# EAGLE design NeoPixel_6x4_Matrix (EAGLE 9.4.2)
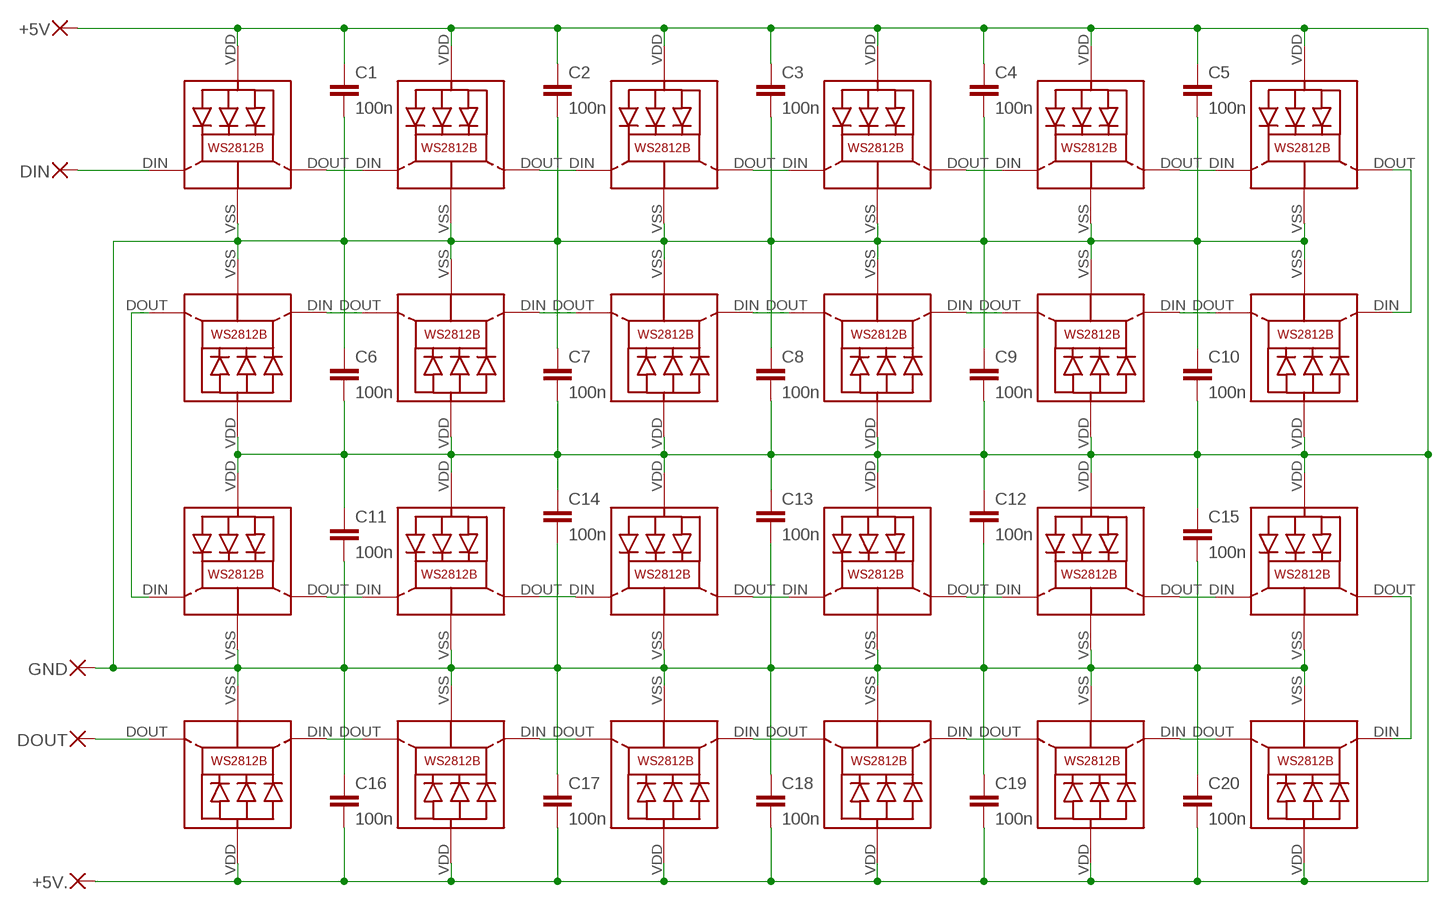
[diagram p0: schematic, sheet 1]

## Parts
+5V  1,6/0,8  [1,6/0,8]
+5V.  1,6/0,8  [1,6/0,8]
C1  100n  C-EUC0603  [C0603]
C2  100n  C-EUC0603  [C0603]
C3  100n  C-EUC0603  [C0603]
C4  100n  C-EUC0603  [C0603]
C5  100n  C-EUC0603  [C0603]
C6  100n  C-EUC0603  [C0603]
C7  100n  C-EUC0603  [C0603]
C8  100n  C-EUC0603  [C0603]
C9  100n  C-EUC0603  [C0603]
C10  100n  C-EUC0603  [C0603]
C11  100n  C-EUC0603  [C0603]
C12  100n  C-EUC0603  [C0603]
C13  100n  C-EUC0603  [C0603]
C14  100n  C-EUC0603  [C0603]
C15  100n  C-EUC0603  [C0603]
C16  100n  C-EUC0603  [C0603]
C17  100n  C-EUC0603  [C0603]
C18  100n  C-EUC0603  [C0603]
C19  100n  C-EUC0603  [C0603]
C20  100n  C-EUC0603  [C0603]
DIN  1,6/0,8  [1,6/0,8]
DOUT  1,6/0,8  [1,6/0,8]
GND  1,6/0,8  [1,6/0,8]
LED1  WS2812B  [WS2812B]
LED2  WS2812B  [WS2812B]
LED3  WS2812B  [WS2812B]
LED4  WS2812B  [WS2812B]
LED5  WS2812B  [WS2812B]
LED6  WS2812B  [WS2812B]
LED7  WS2812B  [WS2812B]
LED8  WS2812B  [WS2812B]
LED9  WS2812B  [WS2812B]
LED10  WS2812B  [WS2812B]
LED11  WS2812B  [WS2812B]
LED12  WS2812B  [WS2812B]
LED13  WS2812B  [WS2812B]
LED14  WS2812B  [WS2812B]
LED15  WS2812B  [WS2812B]
LED16  WS2812B  [WS2812B]
LED17  WS2812B  [WS2812B]
LED18  WS2812B  [WS2812B]
LED19  WS2812B  [WS2812B]
LED20  WS2812B  [WS2812B]
LED21  WS2812B  [WS2812B]
LED22  WS2812B  [WS2812B]
LED23  WS2812B  [WS2812B]
LED24  WS2812B  [WS2812B]

## Nets
1-2: LED2.DOUT(DO) LED3.DIN(DI)
2-3: LED3.DOUT(DO) LED4.DIN(DI)
3-4: LED4.DOUT(DO) LED5.DIN(DI)
4-5: LED6.DOUT(DO) LED7.DIN(DI)
5-6: LED8.DOUT(DO) LED9.DIN(DI)
6-7: LED9.DOUT(DO) LED10.DIN(DI)
7-8: LED10.DOUT(DO) LED11.DIN(DI)
8-9: LED12.DOUT(DO) LED13.DIN(DI)
9-10: LED14.DOUT(DO) LED15.DIN(DI)
10-11: LED15.DOUT(DO) LED16.DIN(DI)
11-12: LED16.DOUT(DO) LED17.DIN(DI)
12-13: LED18.DOUT(DO) LED19.DIN(DI)
13-14: LED20.DOUT(DO) LED21.DIN(DI)
14-15: LED21.DOUT(DO) LED22.DIN(DI)
15-16: LED22.DOUT(DO) LED23.DIN(DI)
N$3: LED1.DOUT(DO) LED2.DIN(DI)
N$4: DIN.1(P) LED1.DIN(DI)
N$5: LED5.DOUT(DO) LED6.DIN(DI)
N$6: LED7.DOUT(DO) LED8.DIN(DI)
N$7: DOUT.1(P) LED24.DOUT(DO)
N$8: LED17.DOUT(DO) LED18.DIN(DI)
N$9: LED11.DOUT(DO) LED12.DIN(DI)
N$10: LED13.DOUT(DO) LED14.DIN(DI)
N$11: LED23.DOUT(DO) LED24.DIN(DI)
N$12: LED19.DOUT(DO) LED20.DIN(DI)
VDD: +5V.1(P) +5V..1(P) C1.1 C2.1 C3.1 C4.1 C5.1 C6.2 C7.2 C8.2 C9.2 C10.2 C11.1 C12.1 C13.1 C14.1 C15.1 C16.2 C17.2 C18.2 C19.2 C20.2 LED1.VDD LED2.VDD LED3.VDD LED4.VDD LED5.VDD LED6.VDD LED7.VDD LED8.VDD LED9.VDD LED10.VDD LED11.VDD LED12.VDD LED13.VDD LED14.VDD LED15.VDD LED16.VDD LED17.VDD LED18.VDD LED19.VDD LED20.VDD LED21.VDD LED22.VDD LED23.VDD LED24.VDD
VSS: C1.2 C2.2 C3.2 C4.2 C5.2 C6.1 C7.1 C8.1 C9.1 C10.1 C11.2 C12.2 C13.2 C14.2 C15.2 C16.1 C17.1 C18.1 C19.1 C20.1 GND.1(P) LED1.VSS(GND) LED2.VSS(GND) LED3.VSS(GND) LED4.VSS(GND) LED5.VSS(GND) LED6.VSS(GND) LED7.VSS(GND) LED8.VSS(GND) LED9.VSS(GND) LED10.VSS(GND) LED11.VSS(GND) LED12.VSS(GND) LED13.VSS(GND) LED14.VSS(GND) LED15.VSS(GND) LED16.VSS(GND) LED17.VSS(GND) LED18.VSS(GND) LED19.VSS(GND) LED20.VSS(GND) LED21.VSS(GND) LED22.VSS(GND) LED23.VSS(GND) LED24.VSS(GND)

## Library data of the parts
+5V +5V. DIN DOUT GND = wirepad:1,6/0,8: THROUGH-HOLE PAD
C1-C20 = rcl:C-EU: CAPACITOR, European symbol
LED1-LED24 = WS2812B:WS2812B: Features and Benefits  * Intelligent reverse connect protection, the power supply reverse connection does not damage the IC. * The control circuit and the LED share the only power source. Control circuit and RGB chip are integrated in a package of 5050 components, form a complete control of pixel point.  * Built-in signal reshaping circuit, after wave reshaping to the next driver, ensure wave-form distortion not accumulate.  * Built-in electric reset circuit and power lost reset circuit.  * Each pixel of the three primary color can achieve 256 brightness display, completed 16777216 color full color display, and scan frequency not less than 400Hz/s.  * Cascading port transmission signal by single line.  * Any two point the distance more than 5m transmission signal without any increase circuit.  * When the refresh rate is 30fps, cascade number are not less than1024 points.  * Send data at speeds of 800Kbps.  *The color of the light were highly consistent, cost-effective. Applications  Full-color module, Full color soft lights a lamp strip. LED decorative lighting, Indoor/outdoor LED video irregular screen. General description WS2812B is a intelligent control LED light source that the control circuit and RGB chip are integrated in a package of 5050 components. It internal include intelligent digital port data latch and signal reshaping amplification drive circuit. Also include a precision internal oscillator and a 12V voltage programmable constant curre-nt control part, effectively ensuring the pixel point light color height consistent. The data transfer protocol use single NZR communication mode. After the pixel power-on reset, the DIN port receive data from controller, the first pixel collect initial 24bit data then sent to the internal data latch, the other data which reshaping by the internal signal reshaping amplification circuit sent to the next cascade pixel through the DO port. After transmission for each pixel,the signal to reduce 24bit. pixel adopt auto reshaping transmit technology, making the pixel cascade number is not limited the signal transmission, only depend on the speed of signal transmission. LED with low driving voltage, environmental protection and energy saving, high brightness, scattering angle is large, good consistency, low power, long life and other advantages. The control chip integrated in LED above becoming more simple circuit, small volume, convenient installation. Absolute Maximum Ratings Power supply voltage: VDD +3.5V..+5.3V Input voltage: VI -0.5V..VDD+0.5V based on WS2812 from https://github.com/adafruit/Adafruit-Eagle-Library

## Board
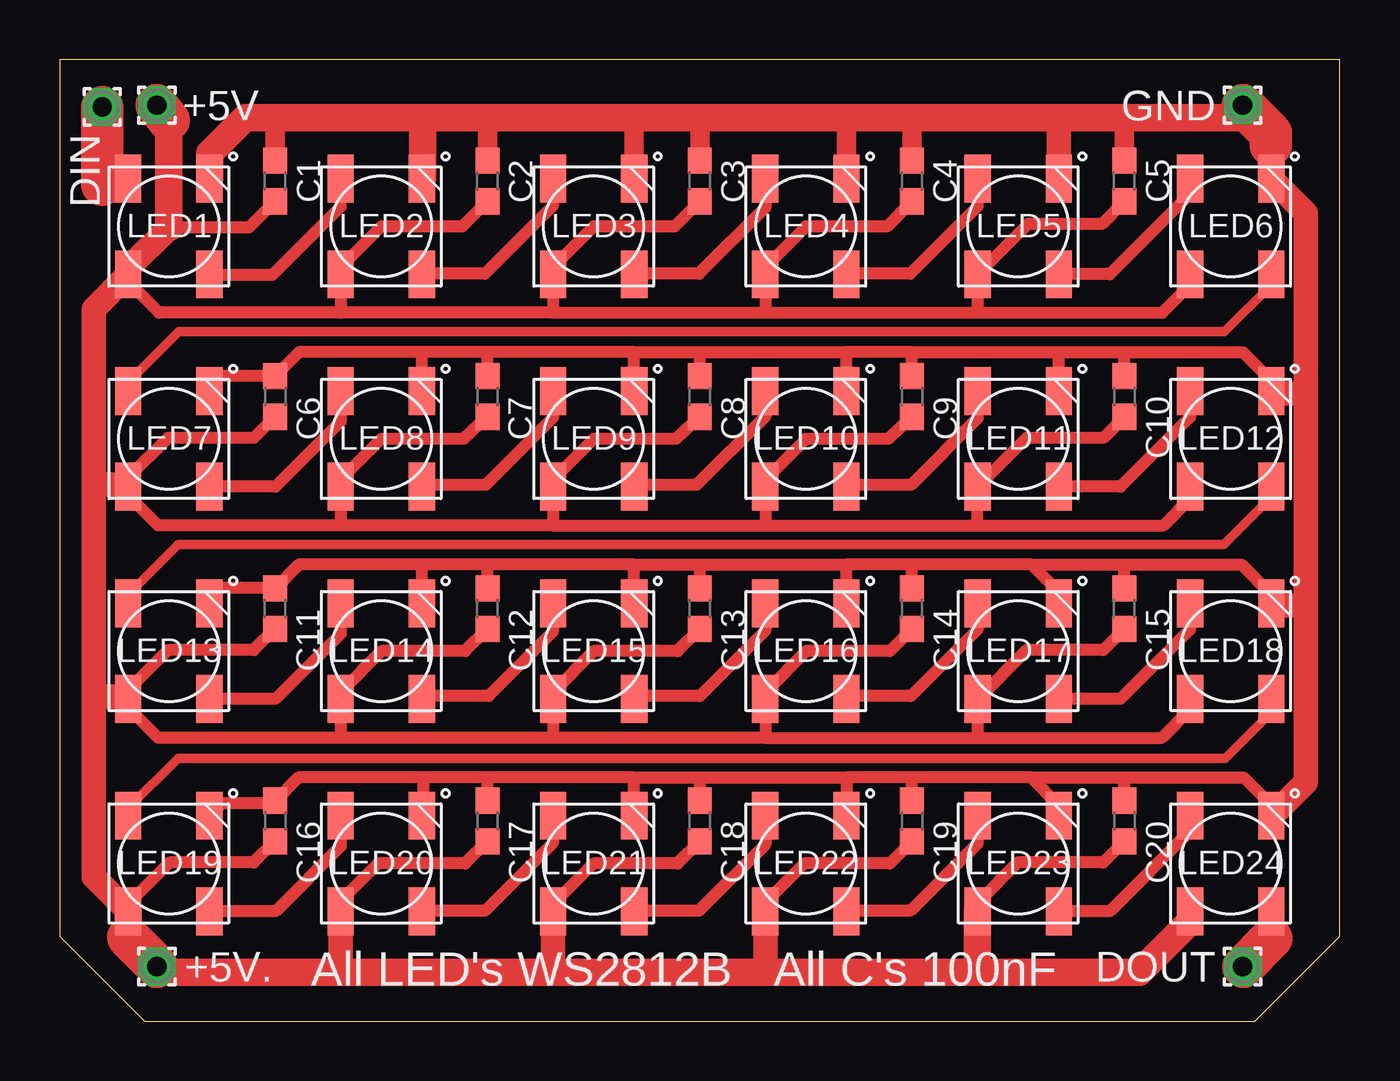
[diagram p1: board, top side]

Size 53.59 x 40.26 mm. Coordinates in mm from the lower left corner, seen from the top.
Outline: 3.56,0 50.04,0 53.59,3.56 53.59,40.26 0,40.26 0,3.56 3.56,0
Copper layers (1*16): Top 0.035mm / dielectric 1.5mm / Bottom 0.035mm
Design rules "default *": minimum track width 6mil, minimum drill 0.35mm, track to track 6mil, track to pad 6mil, pad to pad 6mil, via to via 6mil, smd to smd 6mil, copper to edge 20mil, drill to drill 6mil, minimum pad ring 10mil, minimum via ring 8mil, stop-mask expansion 4mil, vias tented up to drill 0mil, thermal gap 10mil

### Footprints (pad centres in the part's own frame; a part is rotated, then mirrored left to right if it is on the bottom)
1,6/0,8 = drill 0.813 pad 1.6 octagon: 1 0,0
C0603 = smd 1.1 x 1: 1 -0.85,0; 2 0.85,0
WS2812B = smd 2 x 1.1: DIN 2,1.7; DOUT -2,-1.7; VDD -2,1.7; VSS 2,-1.7

### Placement (x,y rotation side)
+5V  4.06,38.35 0 top
+5V.  4.06,2.29 0 top
C1  9.02,35.18 90 top
C2  17.91,35.18 90 top
C3  26.8,35.18 90 top
C4  35.69,35.18 90 top
C5  44.58,35.18 90 top
C6  9.02,26.16 270 top
C7  17.91,26.16 270 top
C8  26.8,26.16 270 top
C9  35.69,26.16 270 top
C10  44.58,26.16 270 top
C11  9.02,17.27 90 top
C12  17.91,17.27 90 top
C13  26.8,17.27 90 top
C14  35.69,17.27 90 top
C15  44.58,17.27 90 top
C16  9.02,8.38 270 top
C17  17.91,8.38 270 top
C18  26.8,8.38 270 top
C19  35.69,8.38 270 top
C20  44.58,8.38 270 top
DIN  1.78,38.28 0 top
DOUT  49.53,2.29 0 top
GND  49.53,38.35 0 top
LED1  4.57,33.27 90 top
LED2  13.46,33.27 90 top
LED3  22.35,33.27 90 top
LED4  31.24,33.27 90 top
LED5  40.13,33.27 90 top
LED6  49.02,33.27 90 top
LED7  4.57,24.38 90 top
LED8  13.46,24.38 90 top
LED9  22.35,24.38 90 top
LED10  31.24,24.38 90 top
LED11  40.13,24.38 90 top
LED12  49.02,24.38 90 top
LED13  4.57,15.49 90 top
LED14  13.46,15.49 90 top
LED15  22.35,15.49 90 top
LED16  31.24,15.49 90 top
LED17  40.13,15.49 90 top
LED18  49.02,15.49 90 top
LED19  4.57,6.6 90 top
LED20  13.46,6.6 90 top
LED21  22.35,6.6 90 top
LED22  31.24,6.6 90 top
LED23  40.13,6.6 90 top
LED24  49.02,6.6 90 top

### Tracks (layer width: path | path; a pad name or v marks a point on that pad's centre or on a via)
1-2
  Top 0.152: 15.29,31.29 LED2.DOUT
  Top 0.508: 15.29,31.29 17.8,31.29 20.65,34.14 LED3.DIN
2-3
  Top 0.152: 24.13,31.29 LED3.DOUT
  Top 0.508: 24.13,31.29 26.77,31.29 29.54,34.06 LED4.DIN
3-4
  Top 0.152: 32.97,31.29 LED4.DOUT
  Top 0.508: 32.97,31.29 35.61,31.29 38.43,34.11 LED5.DIN
4-5
  Top 0.406: 2.87,26.76 4.98,28.87 48.76,28.87 50.72,30.83
  Top 0.508: LED7.DIN 2.87,26.76 | LED6.DOUT 50.72,30.83
5-6
  Top 0.152: 15.29,22.45 LED8.DOUT
  Top 0.508: 15.29,22.45 17.83,22.45 20.65,25.27 LED9.DIN
6-7
  Top 0.152: 24.13,22.45 LED9.DOUT
  Top 0.508: 24.13,22.45 26.67,22.45 29.54,25.33 LED10.DIN
7-8
  Top 0.152: 32.97,22.45 LED10.DOUT
  Top 0.508: 32.97,22.45 35.64,22.45 38.43,25.25 LED11.DIN
8-9
  Top 0.406: 50.72,21.94 48.75,19.96 4.97,19.96 2.87,17.87
  Top 0.508: LED12.DOUT 50.72,21.94 | LED13.DIN 2.87,17.87
9-10
  Top 0.152: 15.29,13.61 LED14.DOUT
  Top 0.508: 15.29,13.61 17.96,13.61 20.65,16.31 LED15.DIN
10-11
  Top 0.152: 24.13,13.61 LED15.DOUT
  Top 0.508: 24.13,13.61 26.8,13.61 29.54,16.36 LED16.DIN
11-12
  Top 0.152: 32.97,13.61 LED16.DOUT
  Top 0.508: 32.97,13.61 35.64,13.61 38.43,16.41 LED17.DIN
12-13
  Top 0.406: 2.87,8.92 4.96,11.01 48.8,11.01 50.72,12.93
  Top 0.508: 2.87,8.92 LED19.DIN | LED18.DOUT 50.72,12.93
13-14
  Top 0.152: 15.29,4.62 LED20.DOUT
  Top 0.508: 15.29,4.62 17.8,4.62 20.65,7.47 LED21.DIN
14-15
  Top 0.152: 24.13,4.62 LED21.DOUT
  Top 0.508: 24.13,4.62 26.77,4.62 29.54,7.39 LED22.DIN
15-16
  Top 0.152: 32.97,4.62 LED22.DOUT
  Top 0.508: 32.97,4.62 35.61,4.62 38.43,7.44 LED23.DIN
N$3
  Top 0.508: LED1.DOUT 6.3,31.24 8.89,31.24 11.76,34.11 LED2.DIN
N$4
  Top 1.016: LED1.DIN 2.62,35.02
  Top 1.524: 2.62,35.02 1.78,35.02
  Top 1.778: 1.78,35.02 DIN.1
N$5
  Top 0.508: LED6.DIN 47.32,34.64 43.96,31.27 LED5.DOUT
N$6
  Top 0.508: LED8.DIN 11.76,25.11 9.03,22.38 LED7.DOUT
N$7
  Top 0.508: LED24.DOUT 50.72,3.46
  Top 1.524: DOUT.1 49.55,2.29
  Top 1.778: 50.72,3.46 49.55,2.29
N$8
  Top 0.508: LED18.DIN 47.32,16.4 44.42,13.49 LED17.DOUT
N$9
  Top 0.508: LED12.DIN 47.32,25.29 44.42,22.38 LED11.DOUT
N$10
  Top 0.508: LED14.DIN 11.76,16.22 9.03,13.49 LED13.DOUT
N$11
  Top 0.508: LED24.DIN 47.32,7.97 43.96,4.6 LED23.DOUT
N$12
  Top 0.508: LED20.DIN 11.76,7.33 9.03,4.6 LED19.DOUT
VDD
  Top 0.152: 38.46,5.33 38.46,5 | 38.46,4.62 LED23.VDD | 29.62,4.62 LED22.VDD | 11.76,31.57 LED2.VDD | 38.43,22.12 LED11.VDD | LED10.VDD 29.54,21.99
  Top 0.254: 20.65,20.78 20.64,20.76 | 29.54,20.78 29.53,20.76
  Top 0.508: C17.2 16.98,6.6 13.34,6.6 11.76,5.03 | C18.2 25.87,6.6 22.35,6.6 20.65,4.9 LED21.VDD | C19.2 34.76,6.6 31.18,6.6 29.54,4.97 LED22.VDD | LED2.VDD 11.76,29.7 11.8,29.67 | 20.65,29.67 11.8,29.67 | 20.65,29.67 29.54,29.67 | 20.65,29.67 LED3.VDD 20.65,31.57 22.35,33.27 25.74,33.27 C3.1 | 38.47,29.67 38.43,29.7 LED5.VDD 40.54,33.38 43.63,33.38 C5.1 | 29.54,29.67 38.47,29.67 | 29.54,29.67 LED4.VDD 29.54,31.57 31.24,33.27 34.63,33.27 C4.1 | C2.1 16.85,33.27 13.46,33.27 11.76,31.57 | 20.65,11.86 LED15.VDD 20.65,13.79 22.35,15.49 25.87,15.49 C13.1 | 29.54,11.86 20.65,11.86 | 38.43,11.86 LED17.VDD 40.48,15.53 43.69,15.53 C15.1 | 29.54,11.86 38.43,11.86 | 29.54,11.86 LED16.VDD 29.54,13.79 31.24,15.49 34.76,15.49 C14.1 | 11.8,11.86 11.76,11.9 LED14.VDD 11.76,13.79 13.46,15.49 16.98,15.49 C12.1 | 20.65,11.86 11.8,11.86 | LED8.VDD 11.76,21.94 | LED8.VDD 11.76,20.92 11.92,20.76 | 11.92,20.76 20.64,20.76 29.53,20.76 38.43,20.76 | 38.43,20.76 38.43,22.12 | 20.65,20.78 LED9.VDD 20.65,22.68 22.35,24.38 25.81,24.38 C8.2 | 29.54,20.78 LED10.VDD 29.54,22.68 31.24,24.38 34.7,24.38 C9.2 | C7.2 16.92,24.38 13.46,24.38 11.76,22.68 LED8.VDD | C16.2 8.13,6.64 4.6,6.64 2.87,4.92 LED19.VDD | C11.1 8.13,15.53 4.54,15.53 2.87,13.87 LED13.VDD 2.87,13.11 4.12,11.86 11.8,11.86 | C6.2 8.13,24.42 4.54,24.42 2.87,22.76 LED7.VDD 2.87,22.01 4.12,20.76 11.92,20.76 | C1.1 7.92,33.23 4.58,33.23 | 2.87,31.53 LED1.VDD 2.87,30.96 4.16,29.67 11.8,29.67 | C10.2 43.69,24.42 40.48,24.42 LED11.VDD | C20.2 43.69,6.64 40.1,6.64 38.46,5 38.46,4.63 LED23.VDD | 38.47,29.67 46.16,29.67 47.32,30.83 LED6.VDD | 38.43,20.76 46.21,20.76 47.32,21.88 LED12.VDD
  Top 0.508: 38.43,11.86 46.13,11.86 47.32,13.05 LED18.VDD | 47.32,4.16 LED24.VDD | +5V..1 3.94,2.04
  Top 1.016: LED21.VDD 20.65,2.04 | LED22.VDD 29.54,2.04 | LED23.VDD 38.45,4.59 | 11.76,5.03 LED20.VDD 11.76,2.04 | 4.58,33.23 2.87,31.53 | LED1.VDD 1.42,29.82 1.42,22.48 | LED19.VDD 1.42,6.05 1.42,13.59 | 1.42,22.48 1.42,13.59 | LED7.VDD 2.78,22.48 1.42,22.48 | LED13.VDD 2.78,13.59 1.42,13.59
  Top 1.143: 3.94,2.04 11.76,2.04 20.65,2.04 29.54,2.04 45.21,2.04 47.32,4.16 | 2.87,3.51 LED19.VDD | 4.58,33.23 4.57,33.24 4.57,37.72 | 38.43,2.06 LED23.VDD
  Top 1.778: +5V..1 4.06,2.32 2.87,3.51 | 4.57,37.72 +5V.1
VSS
  Top 0.152: LED21.VSS 24.05,10.21 | 15.29,8.74 15.21,8.66 LED20.VSS | 32.82,7.72 32.82,8.59 LED22.VSS
  Top 0.508: LED8.VSS 15.16,27.86 15.32,28.02 | 24.05,28.02 17.91,28.02 | 17.91,28.02 15.32,28.02 | LED9.VSS 24.05,28.02 | LED10.VSS 32.94,28.02 | 24.05,28.02 26.8,28.02 | 26.8,28.02 32.94,28.02 | LED5.VSS 41.83,35.16 | 35.69,28.02 41.67,28.02 | 35.69,28.02 32.94,28.02 | LED11.VSS 41.83,27.85 41.67,28.02 | C7.1 17.91,28.02 | C8.1 26.8,28.02 | C9.1 35.69,28.02 | LED23.VSS 41.83,9.04 40.68,10.2 | LED14.VSS 15.16,19.02 15.25,19.11 | 24.05,19.11 17.91,19.11 | 17.91,19.11 15.25,19.11 | LED15.VSS 24.05,19.11 | LED16.VSS 32.94,19.11 | 24.05,19.11 26.8,19.11 | 26.8,19.11 32.94,19.11 | LED17.VSS 41.83,17.97 40.69,19.11 | 40.69,19.11 35.69,19.11 | 35.69,19.11 32.94,19.11 | 40.68,10.2 35.69,10.2 | 35.69,10.2 32.94,10.2 | 32.94,10.2 LED22.VSS | LED21.VSS 24.05,10.2 | 24.05,10.2 26.8,10.2 | 26.8,10.2 32.94,10.2 | 24.05,10.2 17.91,10.2 | 17.91,10.2 15.28,10.2 | 15.28,10.2 15.21,10.13 15.21,8.66 | C12.2 17.91,19.11 | C13.2 26.8,19.11 | C14.2 35.69,19.11 | C17.1 17.91,10.2 | C18.1 26.8,10.2 | C19.1 35.69,10.2 | LED1.VSS 6.27,35.91 | 15.21,37.68 15.31,37.68 | 15.32,28.02 10.02,28.02 C6.1 9.01,27.02 6.27,27.02 LED7.VSS | 15.25,19.11 10.01,19.11 C11.2 9.01,18.13 6.27,18.13 LED13.VSS | 15.28,10.2 9.98,10.2 C16.1 8.9,9.11 6.78,9.11 LED19.VSS | 41.67,28.02 44.58,28.02 | 44.58,28.02 49.53,28.02 50.72,26.83 LED12.VSS | C10.1 44.58,28.02 | 40.69,19.11 44.58,19.11 | 44.58,19.11 49.48,19.11 50.72,17.88 LED18.VSS | C15.2 44.58,19.11 | 40.68,10.2 44.58,10.2 | 44.58,10.2 49.57,10.2 50.72,9.05 LED24.VSS | C20.1 44.58,10.2
  Top 0.813: LED3.VSS 24.05,37.83 | LED4.VSS 32.94,37.83 | C2.2 17.91,37.83 | C3.2 26.8,37.83 | C4.2 35.69,37.83 | C5.2 44.58,37.83 | C1.2 9.02,37.73 9.12,37.83
  Top 1.016: LED5.VSS 41.83,37.83 | 15.28,37.83 15.36,37.83 | LED6.VSS 52.17,33.82 52.17,26.29 | 52.17,26.29 52.17,17.4 | 52.17,17.4 52.17,10.01 50.77,8.6 LED24.VSS | LED18.VSS 50.82,17.4 52.17,17.4 | LED12.VSS 50.82,26.29 52.17,26.29
  Top 1.143: LED2.VSS 15.2,35.31 15.2,37.56 15.31,37.68 | 15.29,37.83 15.28,37.83 | 15.36,37.83 15.21,37.68 | 15.29,37.83 17.91,37.83 24.05,37.83 26.8,37.83 32.94,37.83 35.69,37.83 41.83,37.83 44.58,37.83 49.53,37.83 GND.1 | LED1.VSS 6.27,36.34 7.76,37.83 9.12,37.83 15.29,37.83 | 50.7,37.19 50.72,37.16 LED6.VSS
  Top 1.778: GND.1 50.7,37.19 50.7,36.68

### Text on the board
tNames: All LED's WS2812B | All C's 100nF